# Altium schematic sheet RPI_CM5_PINOUT.SchDoc
size C; SheetNumber: 4; SheetTotal: 17
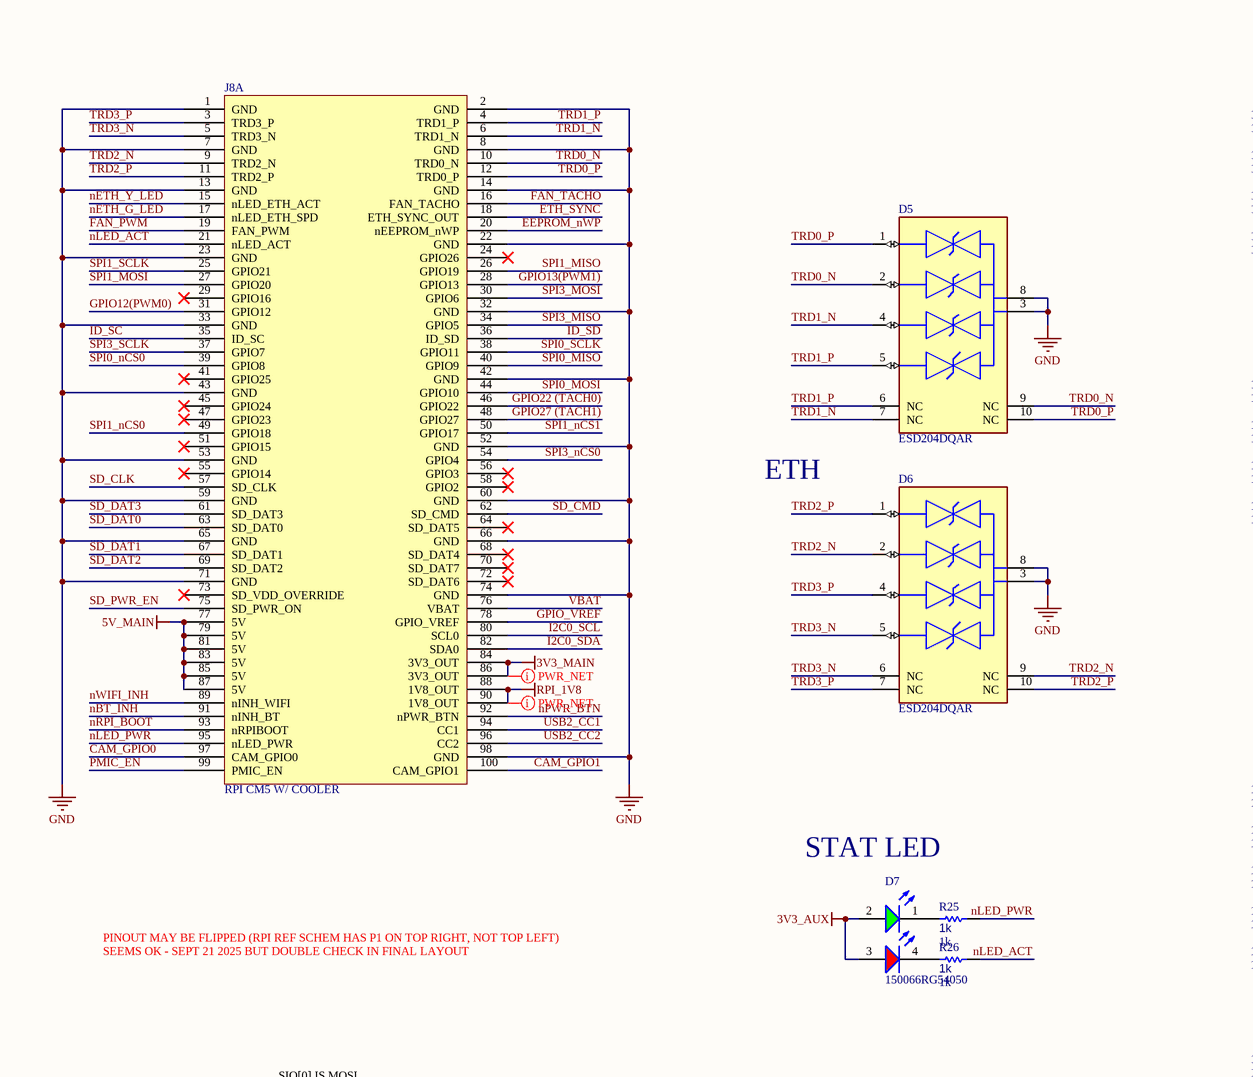
[diagram p0: RPI_CM5_PINOUT.SchDoc, top left]
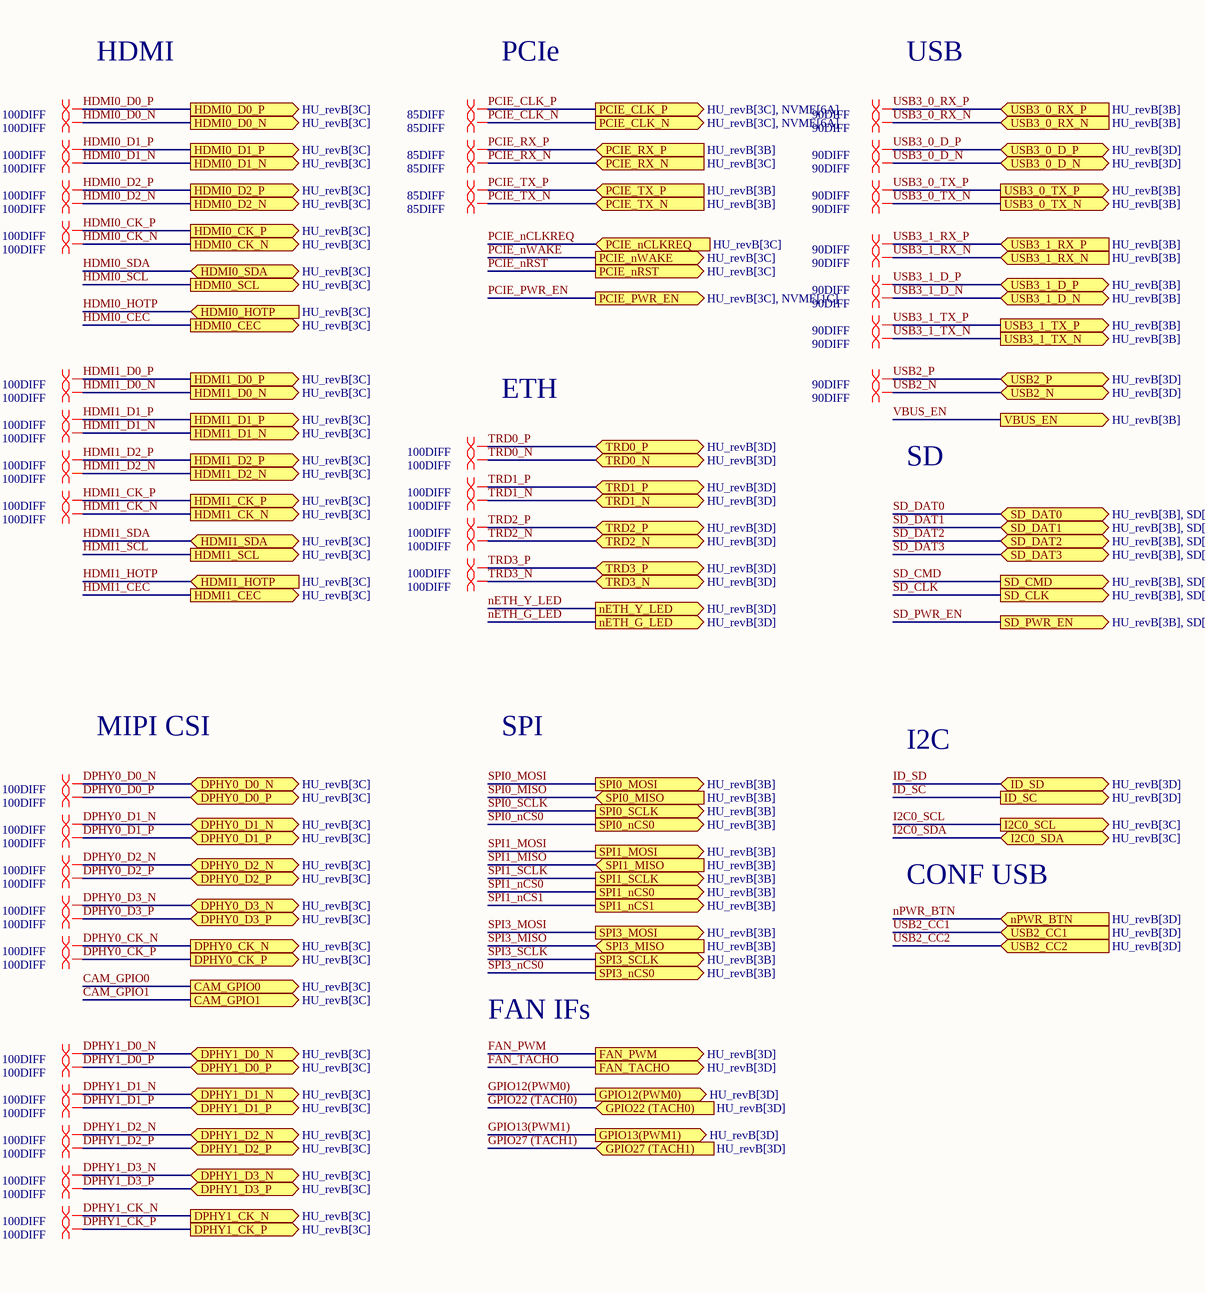
[diagram p1: RPI_CM5_PINOUT.SchDoc, top right]
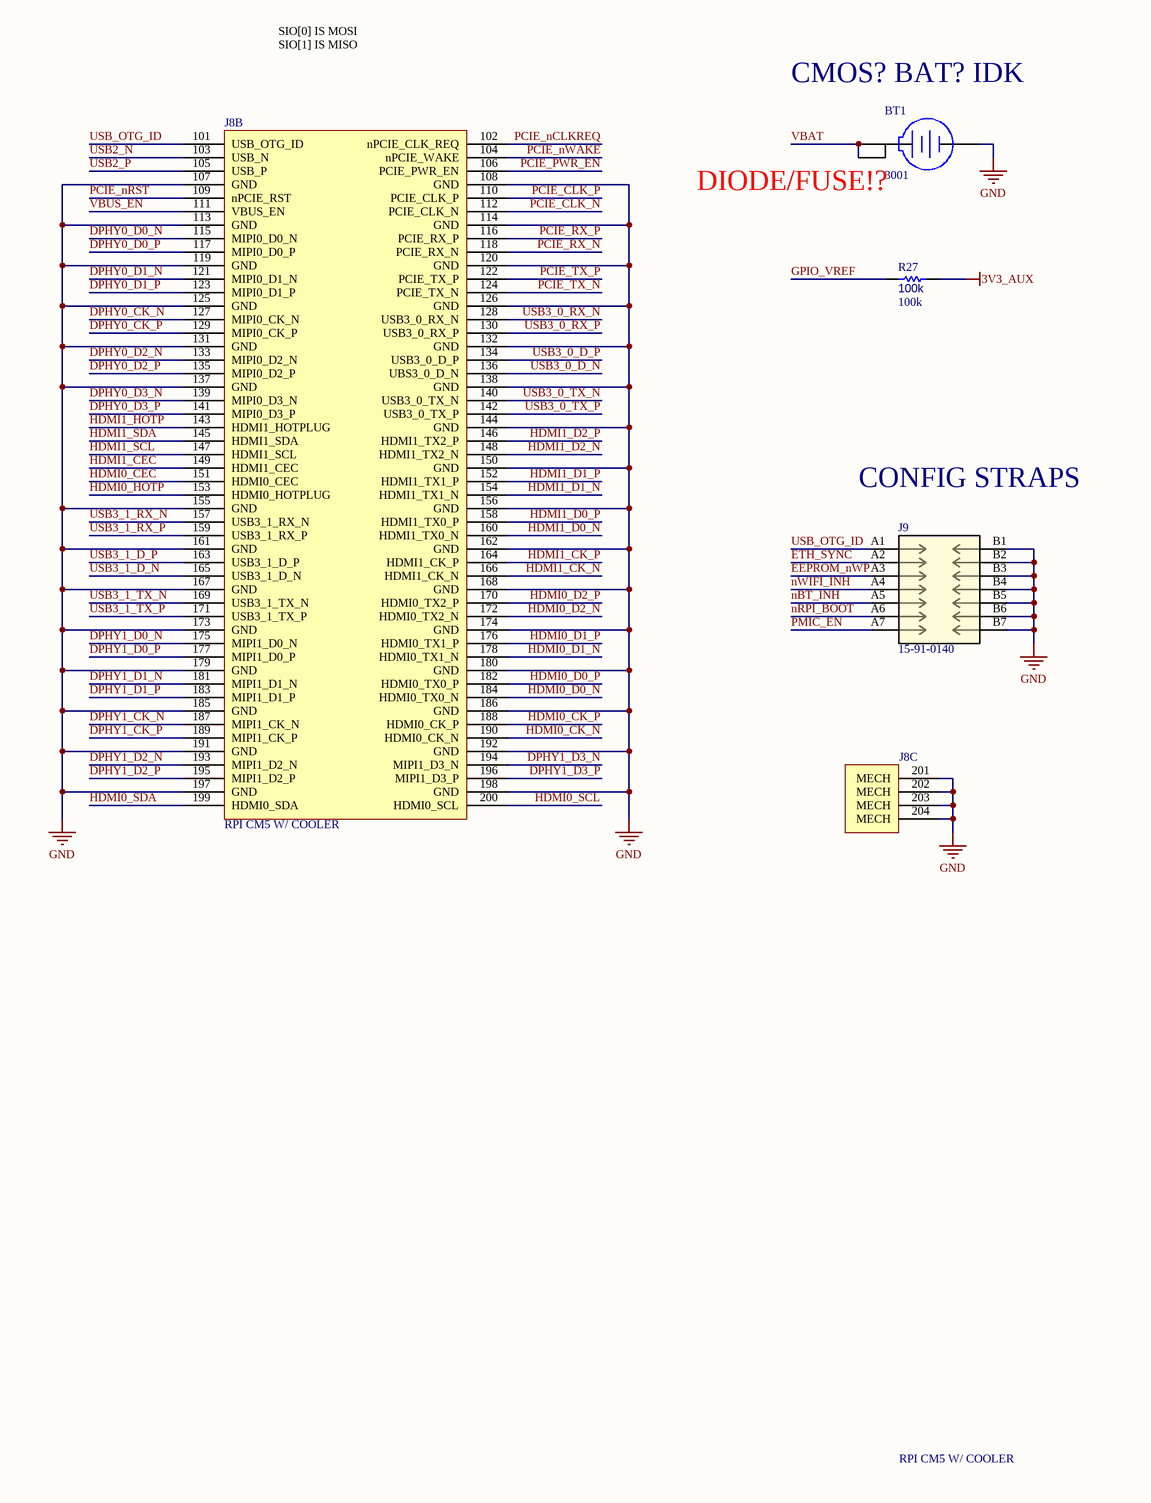
[diagram p2: RPI_CM5_PINOUT.SchDoc, bottom left]
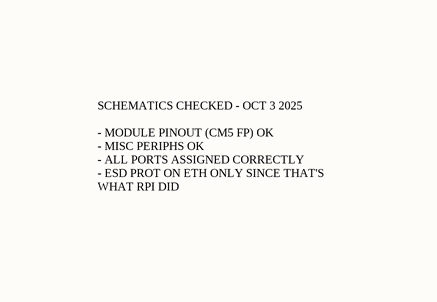
[diagram p3: RPI_CM5_PINOUT.SchDoc, bottom right]

## Parts
BT1  3001  [KSTN-3001_V]
D5  ESD204DQAR  [FP-DQA0010A-MFG]
D6  ESD204DQAR  [FP-DQA0010A-MFG]
D7  150066RG54050  [WL-SBCD_0606]
J8  RPI CM5 W/ COOLER  [RPI CM5 W_ COOLER-Footprint-1]  (parts A,B,C of 3)
J9  15-91-0140  [15-91-0140-Footprint-1]
R25  1k  [R0603B]
R26  1k  [R0603B]
R27  100k  [R0603B]

## Ports
CAM_GPIO0 (out, see HU_revB[3C]), CAM_GPIO1 (out, see HU_revB[3C]), DPHY0_CK_N (out, see HU_revB[3C]), DPHY0_CK_P (out, see HU_revB[3C]), DPHY0_D0_N (bidir, see HU_revB[3C]), DPHY0_D0_P (bidir, see HU_revB[3C]), DPHY0_D1_N (bidir, see HU_revB[3C]), DPHY0_D1_P (bidir, see HU_revB[3C]), DPHY0_D2_N (bidir, see HU_revB[3C]), DPHY0_D2_P (bidir, see HU_revB[3C]), DPHY0_D3_N (bidir, see HU_revB[3C]), DPHY0_D3_P (bidir, see HU_revB[3C]), DPHY1_CK_N (out, see HU_revB[3C]), DPHY1_CK_P (out, see HU_revB[3C]), DPHY1_D0_N (bidir, see HU_revB[3C]), DPHY1_D0_P (bidir, see HU_revB[3C]), DPHY1_D1_N (bidir, see HU_revB[3C]), DPHY1_D1_P (bidir, see HU_revB[3C]), DPHY1_D2_N (bidir, see HU_revB[3C]), DPHY1_D2_P (bidir, see HU_revB[3C]), DPHY1_D3_N (bidir, see HU_revB[3C]), DPHY1_D3_P (bidir, see HU_revB[3C]), FAN_PWM (out, see HU_revB[3D]), FAN_TACHO (out, see HU_revB[3D]), GPIO12(PWM0) (out, see HU_revB[3D]), GPIO13(PWM1) (out, see HU_revB[3D]), GPIO22 (TACH0) (in, see HU_revB[3D]), GPIO27 (TACH1) (in, see HU_revB[3D]), HDMI0_CEC (out, see HU_revB[3C]), HDMI0_CK_N (out, see HU_revB[3C]), HDMI0_CK_P (out, see HU_revB[3C]), HDMI0_D0_N (out, see HU_revB[3C]), HDMI0_D0_P (out, see HU_revB[3C]), HDMI0_D1_N (out, see HU_revB[3C]), HDMI0_D1_P (out, see HU_revB[3C]), HDMI0_D2_N (out, see HU_revB[3C]), HDMI0_D2_P (out, see HU_revB[3C]), HDMI0_HOTP (in, see HU_revB[3C]), HDMI0_SCL (out, see HU_revB[3C]), HDMI0_SDA (bidir, see HU_revB[3C]), HDMI1_CEC (out, see HU_revB[3C]), HDMI1_CK_N (out, see HU_revB[3C]), HDMI1_CK_P (out, see HU_revB[3C]), HDMI1_D0_N (out, see HU_revB[3C]), HDMI1_D0_P (out, see HU_revB[3C]), HDMI1_D1_N (out, see HU_revB[3C]), HDMI1_D1_P (out, see HU_revB[3C]), HDMI1_D2_N (out, see HU_revB[3C]), HDMI1_D2_P (out, see HU_revB[3C]), HDMI1_HOTP (in, see HU_revB[3C]), HDMI1_SCL (out, see HU_revB[3C]), HDMI1_SDA (bidir, see HU_revB[3C]), I2C0_SCL (out, see HU_revB[3C]), I2C0_SDA (bidir, see HU_revB[3C]), ID_SC (out, see HU_revB[3D]), ID_SD (bidir, see HU_revB[3D]), nETH_G_LED (out, see HU_revB[3D]), nETH_Y_LED (out, see HU_revB[3D]), nPWR_BTN (in, see HU_revB[3D]), PCIE_CLK_N (out, see HU_revB[3C], NVME[6A]), PCIE_CLK_P (out, see HU_revB[3C], NVME[6A]), PCIE_nCLKREQ (in, see HU_revB[3C]), PCIE_nRST (out, see HU_revB[3C]), PCIE_nWAKE (out, see HU_revB[3C]), PCIE_PWR_EN (out, see HU_revB[3C], NVME[1C]), PCIE_RX_N (in, see HU_revB[3C]), PCIE_RX_P (in, see HU_revB[3B]), PCIE_TX_N (in, see HU_revB[3B]), PCIE_TX_P (in, see HU_revB[3B]), SD_CLK (out, see HU_revB[3B], SD[3B]), SD_CMD (out, see HU_revB[3B], SD[3B]), SD_DAT0 (bidir, see HU_revB[3B], SD[3B]), SD_DAT1 (bidir, see HU_revB[3B], SD[3B]), SD_DAT2 (bidir, see HU_revB[3B], SD[3B]), SD_DAT3 (bidir, see HU_revB[3B], SD[3B]), SD_PWR_EN (out, see HU_revB[3B], SD[1B]), SPI0_MISO (in, see HU_revB[3B]), SPI0_MOSI (out, see HU_revB[3B]), SPI0_nCS0 (out, see HU_revB[3B]), SPI0_SCLK (out, see HU_revB[3B]), SPI1_MISO (in, see HU_revB[3B]), SPI1_MOSI (out, see HU_revB[3B]), SPI1_nCS0 (out, see HU_revB[3B]), SPI1_nCS1 (out, see HU_revB[3B]), SPI1_SCLK (out, see HU_revB[3B]), SPI3_MISO (in, see HU_revB[3B]), SPI3_MOSI (out, see HU_revB[3B]), SPI3_nCS0 (out, see HU_revB[3B]), SPI3_SCLK (out, see HU_revB[3B]), TRD0_N (bidir, see HU_revB[3D]), TRD0_P (bidir, see HU_revB[3D]), TRD1_N (bidir, see HU_revB[3D]), TRD1_P (bidir, see HU_revB[3D]), TRD2_N (bidir, see HU_revB[3D]), TRD2_P (bidir, see HU_revB[3D]), TRD3_N (bidir, see HU_revB[3D]), TRD3_P (bidir, see HU_revB[3D]), USB2_CC1 (in, see HU_revB[3D]), USB2_CC2 (in, see HU_revB[3D]), USB2_N (bidir, see HU_revB[3D]), USB2_P (bidir, see HU_revB[3D]), USB3_0_D_N (bidir, see HU_revB[3D]), USB3_0_D_P (bidir, see HU_revB[3D]), USB3_0_RX_N (in, see HU_revB[3B]), USB3_0_RX_P (in, see HU_revB[3B]), USB3_0_TX_N (out, see HU_revB[3B]), USB3_0_TX_P (out, see HU_revB[3B]), USB3_1_D_N (bidir, see HU_revB[3B]), USB3_1_D_P (bidir, see HU_revB[3B]), USB3_1_RX_N (in, see HU_revB[3B]), USB3_1_RX_P (in, see HU_revB[3B]), USB3_1_TX_N (out, see HU_revB[3B]), USB3_1_TX_P (out, see HU_revB[3B]), VBUS_EN (out, see HU_revB[3B])

## Nets
3V3_AUX: D7.2(A) D7.3(A) R27.2
3V3_MAIN: J8.84(3V3_OUT) J8.86(3V3_OUT)
5V_MAIN: J8.77(5V) J8.79(5V) J8.81(5V) J8.83(5V) J8.85(5V) J8.87(5V)
GND: BT1.3(-) D5.3(GND) D5.8(GND) D6.3(GND) D6.8(GND) J8.1(GND) J8.2(GND) J8.7(GND) J8.8(GND) J8.13(GND) J8.14(GND) J8.22(GND) J8.23(GND) J8.32(GND) J8.33(GND) J8.42(GND) J8.43(GND) J8.52(GND) J8.53(GND) J8.59(GND) J8.60(GND) J8.65(GND) J8.66(GND) J8.71(GND) J8.74(GND) J8.98(GND) J8.107(GND) J8.108(GND) J8.113(GND) J8.114(GND) J8.119(GND) J8.120(GND) J8.125(GND) J8.126(GND) J8.131(GND) J8.132(GND) J8.137(GND) J8.138(GND) J8.144(GND) J8.150(GND) J8.155(GND) J8.156(GND) J8.161(GND) J8.162(GND) J8.167(GND) J8.168(GND) J8.173(GND) J8.174(GND) J8.179(GND) J8.180(GND) J8.185(GND) J8.186(GND) J8.191(GND) J8.192(GND) J8.197(GND) J8.198(GND) J8.201(MECH) J8.202(MECH) J8.203(MECH) J8.204(MECH) J9.B1 J9.B2 J9.B3 J9.B4 J9.B5 J9.B6 J9.B7
RPI_1V8: J8.88(1V8_OUT) J8.90(1V8_OUT)
CAM_GPIO0: J8.97(CAM_GPIO0) ; port CAM_GPIO0
CAM_GPIO1: J8.100(CAM_GPIO1) ; port CAM_GPIO1
DPHY0_CK_N: J8.127(MIPI0_CK_N) ; port DPHY0_CK_N
DPHY0_CK_P: J8.129(MIPI0_CK_P) ; port DPHY0_CK_P
DPHY0_D0_N: J8.115(MIPI0_D0_N) ; port DPHY0_D0_N
DPHY0_D0_P: J8.117(MIPI0_D0_P) ; port DPHY0_D0_P
DPHY0_D1_N: J8.121(MIPI0_D1_N) ; port DPHY0_D1_N
DPHY0_D1_P: J8.123(MIPI0_D1_P) ; port DPHY0_D1_P
DPHY0_D2_N: J8.133(MIPI0_D2_N) ; port DPHY0_D2_N
DPHY0_D2_P: J8.135(MIPI0_D2_P) ; port DPHY0_D2_P
DPHY0_D3_N: J8.139(MIPI0_D3_N) ; port DPHY0_D3_N
DPHY0_D3_P: J8.141(MIPI0_D3_P) ; port DPHY0_D3_P
DPHY1_CK_N: J8.187(MIPI1_CK_N) ; port DPHY1_CK_N
DPHY1_CK_P: J8.189(MIPI1_CK_P) ; port DPHY1_CK_P
DPHY1_D0_N: J8.175(MIPI1_D0_N) ; port DPHY1_D0_N
DPHY1_D0_P: J8.177(MIPI1_D0_P) ; port DPHY1_D0_P
DPHY1_D1_N: J8.181(MIPI1_D1_N) ; port DPHY1_D1_N
DPHY1_D1_P: J8.183(MIPI1_D1_P) ; port DPHY1_D1_P
DPHY1_D2_N: J8.193(MIPI1_D2_N) ; port DPHY1_D2_N
DPHY1_D2_P: J8.195(MIPI1_D2_P) ; port DPHY1_D2_P
DPHY1_D3_N: J8.194(MIPI1_D3_N) ; port DPHY1_D3_N
DPHY1_D3_P: J8.196(MIPI1_D3_P) ; port DPHY1_D3_P
EEPROM_nWP: J8.20(nEEPROM_nWP) J9.A3
ETH_SYNC: J8.18(ETH_SYNC_OUT) J9.A2
FAN_PWM: J8.19(FAN_PWM) ; port FAN_PWM
FAN_TACHO: J8.16(FAN_TACHO) ; port FAN_TACHO
GPIO12(PWM0): J8.31(GPIO12) ; port GPIO12(PWM0)
GPIO13(PWM1): J8.28(GPIO13) ; port GPIO13(PWM1)
GPIO22 (TACH0): J8.46(GPIO22) ; port GPIO22 (TACH0)
GPIO27 (TACH1): J8.48(GPIO27) ; port GPIO27 (TACH1)
GPIO_VREF: J8.78(GPIO_VREF) R27.1
HDMI0_CEC: J8.151(HDMI0_CEC) ; port HDMI0_CEC
HDMI0_CK_N: J8.190(HDMI0_CK_N) ; port HDMI0_CK_N
HDMI0_CK_P: J8.188(HDMI0_CK_P) ; port HDMI0_CK_P
HDMI0_D0_N: J8.184(HDMI0_TX0_N) ; port HDMI0_D0_N
HDMI0_D0_P: J8.182(HDMI0_TX0_P) ; port HDMI0_D0_P
HDMI0_D1_N: J8.178(HDMI0_TX1_N) ; port HDMI0_D1_N
HDMI0_D1_P: J8.176(HDMI0_TX1_P) ; port HDMI0_D1_P
HDMI0_D2_N: J8.172(HDMI0_TX2_N) ; port HDMI0_D2_N
HDMI0_D2_P: J8.170(HDMI0_TX2_P) ; port HDMI0_D2_P
HDMI0_HOTP: J8.153(HDMI0_HOTPLUG) ; port HDMI0_HOTP
HDMI0_SCL: J8.200(HDMI0_SCL) ; port HDMI0_SCL
HDMI0_SDA: J8.199(HDMI0_SDA) ; port HDMI0_SDA
HDMI1_CEC: J8.149(HDMI1_CEC) ; port HDMI1_CEC
HDMI1_CK_N: J8.166(HDMI1_CK_N) ; port HDMI1_CK_N
HDMI1_CK_P: J8.164(HDMI1_CK_P) ; port HDMI1_CK_P
HDMI1_D0_N: J8.160(HDMI1_TX0_N) ; port HDMI1_D0_N
HDMI1_D0_P: J8.158(HDMI1_TX0_P) ; port HDMI1_D0_P
HDMI1_D1_N: J8.154(HDMI1_TX1_N) ; port HDMI1_D1_N
HDMI1_D1_P: J8.152(HDMI1_TX1_P) ; port HDMI1_D1_P
HDMI1_D2_N: J8.148(HDMI1_TX2_N) ; port HDMI1_D2_N
HDMI1_D2_P: J8.146(HDMI1_TX2_P) ; port HDMI1_D2_P
HDMI1_HOTP: J8.143(HDMI1_HOTPLUG) ; port HDMI1_HOTP
HDMI1_SCL: J8.147(HDMI1_SCL) ; port HDMI1_SCL
HDMI1_SDA: J8.145(HDMI1_SDA) ; port HDMI1_SDA
I2C0_SCL: J8.80(SCL0) ; port I2C0_SCL
I2C0_SDA: J8.82(SDA0) ; port I2C0_SDA
ID_SC: J8.35(ID_SC) ; port ID_SC
ID_SD: J8.36(ID_SD) ; port ID_SD
nBT_INH: J8.91(nINH_BT) J9.A5
nETH_G_LED: J8.17(nLED_ETH_SPD) ; port nETH_G_LED
nETH_Y_LED: J8.15(nLED_ETH_ACT) ; port nETH_Y_LED
nLED_ACT: J8.21(nLED_ACT) R26.2
nLED_PWR: J8.95(nLED_PWR) R25.2
nPWR_BTN: J8.92(nPWR_BTN) ; port nPWR_BTN
nRPI_BOOT: J8.93(nRPIBOOT) J9.A6
nWIFI_INH: J8.89(nINH_WIFI) J9.A4
PCIE_CLK_N: J8.112(PCIE_CLK_N) ; port PCIE_CLK_N
PCIE_CLK_P: J8.110(PCIE_CLK_P) ; port PCIE_CLK_P
PCIE_nCLKREQ: J8.102(nPCIE_CLK_REQ) ; port PCIE_nCLKREQ
PCIE_nRST: J8.109(nPCIE_RST) ; port PCIE_nRST
PCIE_nWAKE: J8.104(nPCIE_WAKE) ; port PCIE_nWAKE
PCIE_PWR_EN: J8.106(PCIE_PWR_EN) ; port PCIE_PWR_EN
PCIE_RX_N: J8.118(PCIE_RX_N) ; port PCIE_RX_N
PCIE_RX_P: J8.116(PCIE_RX_P) ; port PCIE_RX_P
PCIE_TX_N: J8.124(PCIE_TX_N) ; port PCIE_TX_N
PCIE_TX_P: J8.122(PCIE_TX_P) ; port PCIE_TX_P
PMIC_EN: J8.99(PMIC_EN) J9.A7
SD_CLK: J8.57(SD_CLK) ; port SD_CLK
SD_CMD: J8.62(SD_CMD) ; port SD_CMD
SD_DAT0: J8.63(SD_DAT0) ; port SD_DAT0
SD_DAT1: J8.67(SD_DAT1) ; port SD_DAT1
SD_DAT2: J8.69(SD_DAT2) ; port SD_DAT2
SD_DAT3: J8.61(SD_DAT3) ; port SD_DAT3
SD_PWR_EN: J8.75(SD_PWR_ON) ; port SD_PWR_EN
SPI0_MISO: J8.40(GPIO9) ; port SPI0_MISO
SPI0_MOSI: J8.44(GPIO10) ; port SPI0_MOSI
SPI0_nCS0: J8.39(GPIO8) ; port SPI0_nCS0
SPI0_SCLK: J8.38(GPIO11) ; port SPI0_SCLK
SPI1_MISO: J8.26(GPIO19) ; port SPI1_MISO
SPI1_MOSI: J8.27(GPIO20) ; port SPI1_MOSI
SPI1_nCS0: J8.49(GPIO18) ; port SPI1_nCS0
SPI1_nCS1: J8.50(GPIO17) ; port SPI1_nCS1
SPI1_SCLK: J8.25(GPIO21) ; port SPI1_SCLK
SPI3_MISO: J8.34(GPIO5) ; port SPI3_MISO
SPI3_MOSI: J8.30(GPIO6) ; port SPI3_MOSI
SPI3_nCS0: J8.54(GPIO4) ; port SPI3_nCS0
SPI3_SCLK: J8.37(GPIO7) ; port SPI3_SCLK
TRD0_N: D5.2(IO2) D5.9(NC) J8.10(TRD0_N) ; port TRD0_N
TRD0_P: D5.1(IO1) D5.10(NC) J8.12(TRD0_P) ; port TRD0_P
TRD1_N: D5.4(IO3) D5.7(NC) J8.6(TRD1_N) ; port TRD1_N
TRD1_P: D5.5(IO4) D5.6(NC) J8.4(TRD1_P) ; port TRD1_P
TRD2_N: D6.2(IO2) D6.9(NC) J8.9(TRD2_N) ; port TRD2_N
TRD2_P: D6.1(IO1) D6.10(NC) J8.11(TRD2_P) ; port TRD2_P
TRD3_N: D6.5(IO4) D6.6(NC) J8.5(TRD3_N) ; port TRD3_N
TRD3_P: D6.4(IO3) D6.7(NC) J8.3(TRD3_P) ; port TRD3_P
USB2_CC1: J8.94(CC1) ; port USB2_CC1
USB2_CC2: J8.96(CC2) ; port USB2_CC2
USB2_N: J8.103(USB_N) ; port USB2_N
USB2_P: J8.105(USB_P) ; port USB2_P
USB3_0_D_N: J8.136(UBS3_0_D_N) ; port USB3_0_D_N
USB3_0_D_P: J8.134(USB3_0_D_P) ; port USB3_0_D_P
USB3_0_RX_N: J8.128(USB3_0_RX_N) ; port USB3_0_RX_N
USB3_0_RX_P: J8.130(USB3_0_RX_P) ; port USB3_0_RX_P
USB3_0_TX_N: J8.140(USB3_0_TX_N) ; port USB3_0_TX_N
USB3_0_TX_P: J8.142(USB3_0_TX_P) ; port USB3_0_TX_P
USB3_1_D_N: J8.165(USB3_1_D_N) ; port USB3_1_D_N
USB3_1_D_P: J8.163(USB3_1_D_P) ; port USB3_1_D_P
USB3_1_RX_N: J8.157(USB3_1_RX_N) ; port USB3_1_RX_N
USB3_1_RX_P: J8.159(USB3_1_RX_P) ; port USB3_1_RX_P
USB3_1_TX_N: J8.169(USB3_1_TX_N) ; port USB3_1_TX_N
USB3_1_TX_P: J8.171(USB3_1_TX_P) ; port USB3_1_TX_P
USB_OTG_ID: J8.101(USB_OTG_ID) J9.A1
VBAT: BT1.1(+) BT1.2(+) J8.76(VBAT)
VBUS_EN: J8.111(VBUS_EN) ; port VBUS_EN
NetD7_1: D7.1(K) R25.1
NetD7_4: D7.4(K) R26.1

Not connected (* = marked no-connect by the designer): J8 24(GPIO26)* 29(GPIO16)* 41(GPIO25)* 45(GPIO24)* 47(GPIO23)* 51(GPIO15)* 55(GPIO14)* 56(GPIO3)* 58(GPIO2)* 64(SD_DAT5)* 68(SD_DAT4)* 70(SD_DAT7)* 72(SD_DAT6)* 73(SD_VDD_OVERRIDE)*

## Layout directives
differential pair; differential pair class 90DIFF: USB2_N, USB2_P, USB3_0_D_N, USB3_0_D_P, USB3_0_RX_N, USB3_0_RX_P, USB3_0_TX_N, USB3_0_TX_P, USB3_1_D_N, USB3_1_D_P, USB3_1_RX_N, USB3_1_RX_P, USB3_1_TX_N, USB3_1_TX_P
differential pair; differential pair class 100DIFF: DPHY0_CK_N, DPHY0_CK_P, DPHY0_D0_N, DPHY0_D0_P, DPHY0_D1_N, DPHY0_D1_P, DPHY0_D2_N, DPHY0_D2_P, DPHY0_D3_N, DPHY0_D3_P, DPHY1_CK_N, DPHY1_CK_P, DPHY1_D0_N, DPHY1_D0_P, DPHY1_D1_N, DPHY1_D1_P, DPHY1_D2_N, DPHY1_D2_P, DPHY1_D3_N, DPHY1_D3_P, HDMI0_CK_N, HDMI0_CK_P, HDMI0_D0_N, HDMI0_D0_P, HDMI0_D1_N, HDMI0_D1_P, HDMI0_D2_N, HDMI0_D2_P, HDMI1_CK_N, HDMI1_CK_P, HDMI1_D0_N, HDMI1_D0_P, HDMI1_D1_N, HDMI1_D1_P, HDMI1_D2_N, HDMI1_D2_P, TRD0_N, TRD0_P, TRD1_N, TRD1_P, TRD2_N, TRD2_P, TRD3_N, TRD3_P
differential pair; differential pair class 85DIFF: PCIE_CLK_N, PCIE_CLK_P, PCIE_RX_N, PCIE_RX_P, PCIE_TX_N, PCIE_TX_P
net class PWR: 3V3_MAIN, RPI_1V8

## Notes on the sheet
- HDMI
- PCIe
- USB
- ETH
- SD
- MIPI CSI
- SPI
- I2C
- STAT LED
- PINOUT MAY BE FLIPPED (RPI REF SCHEM HAS P1 ON TOP RIGHT, NOT TOP LEFT)
- CONF USB
- SEEMS OK - SEPT 21 2025 BUT DOUBLE CHECK IN FINAL LAYOUT
- FAN IFs
- SIO[0] IS MOSI
  SIO[1] IS MISO
- CMOS? BAT? IDK
- (near BT1) DIODE/FUSE!?
- CONFIG STRAPS
- SCHEMATICS CHECKED - OCT 3 2025
  - MODULE PINOUT (CM5 FP) OK
  - MISC PERIPHS OK
  - ALL PORTS ASSIGNED CORRECTLY
  - ESD PROT ON ETH ONLY SINCE THAT'S WHAT RPI DID

## Library data of the parts
BT1 = CMP-2000-05463-1: Holder Battery Coin, 12 mm, 2-Pin THD, RoHS; Manufacturer: Keystone; Package Reference: 3001; Package Description: 2-Pin Through Hole Device, Body 13.21 x 12.07 mm; Datasheet Version: Rev. H, 09/2006; Datasheet URL: https://datasheet.ciiva.com/3/3001-3954.pdf; Mounting Technology: ThroughHole; Manufacturer URL: http://www.keyelco.com/
D5 D6 = CMP-04989-000002-1: 4-CHANNEL LOW-CAPACITANCE SURGE; Manufacturer: Texas Instruments; Value: 0.55pF; Reverse Standoff Voltage: 3.6V; Standoff Height: 0mm; Breakdown Voltage: 5.5V; Peak Pulse Current: 5.5A; Clamping Voltage: 11.5V; Direction: Bidirectional; Peak Pulse Power: 50W; Number Of Channels: 4; Ambient Temperature Range High: +125°C; ComponentLink2Description: Datasheet; Height: 0.55mm; Lead Free: Yes; Device Class L3: unset; Temperature Range High: +125°C; Temperature Range Low: -40°C; Package: DQA0010A; Temperature: -40°C to +125°C; Capacitance: 0.55pF; RoHS: TRUE; Mouser Description: 4-Channel Low-Capacitance Surge and ESD Protection Diode 10-USON -40 to 125; Category: Diode; Device Class L1: Circuit Protection; Octopart: https://octopart.com/esd204dqar-texas+instruments-89917476; Device Class L2: TVS Diodes; Ambient Temperature Range Low: -40°C; Manufacturer Part Number: ESD204DQAR; ComponentLink2URL: http://www.ti.com/lit/ds/symlink/esd204.pdf; Automotive: No; Digikey Description: 4-CHANNEL LOW-CAPACITANCE SURGE
D7 = CMP-004-00040-2: Led, Red/Grn, 180Mcd/230Mcd, 624Nm/525Nm Rohs Compliant: Yes; Source: rgled.SchLib; Component Type: Standard; Pins: 4; Design Item ID: CMP-004-00034-2
J8 = CMP-00028-00005-4: Mechanical placeholder for RPI CM5 w/ active cooler on it
J9 = CMP-002-00093-2: Conn.; Rect./PCB; Header; 14 Circuit; SMT; Dual Row; Vertical; C-Grid Series; Gold Plate; Gender: Male; Min Operating Temperature: -40°C; Max Operating Temperature: 105°C; Mounting Technology: Surface Mount; Pins: 14
R25-R27 = CMP-009-00002-14: Resistor
  R25 R26: Value: 1k
  R27: Value: 100k